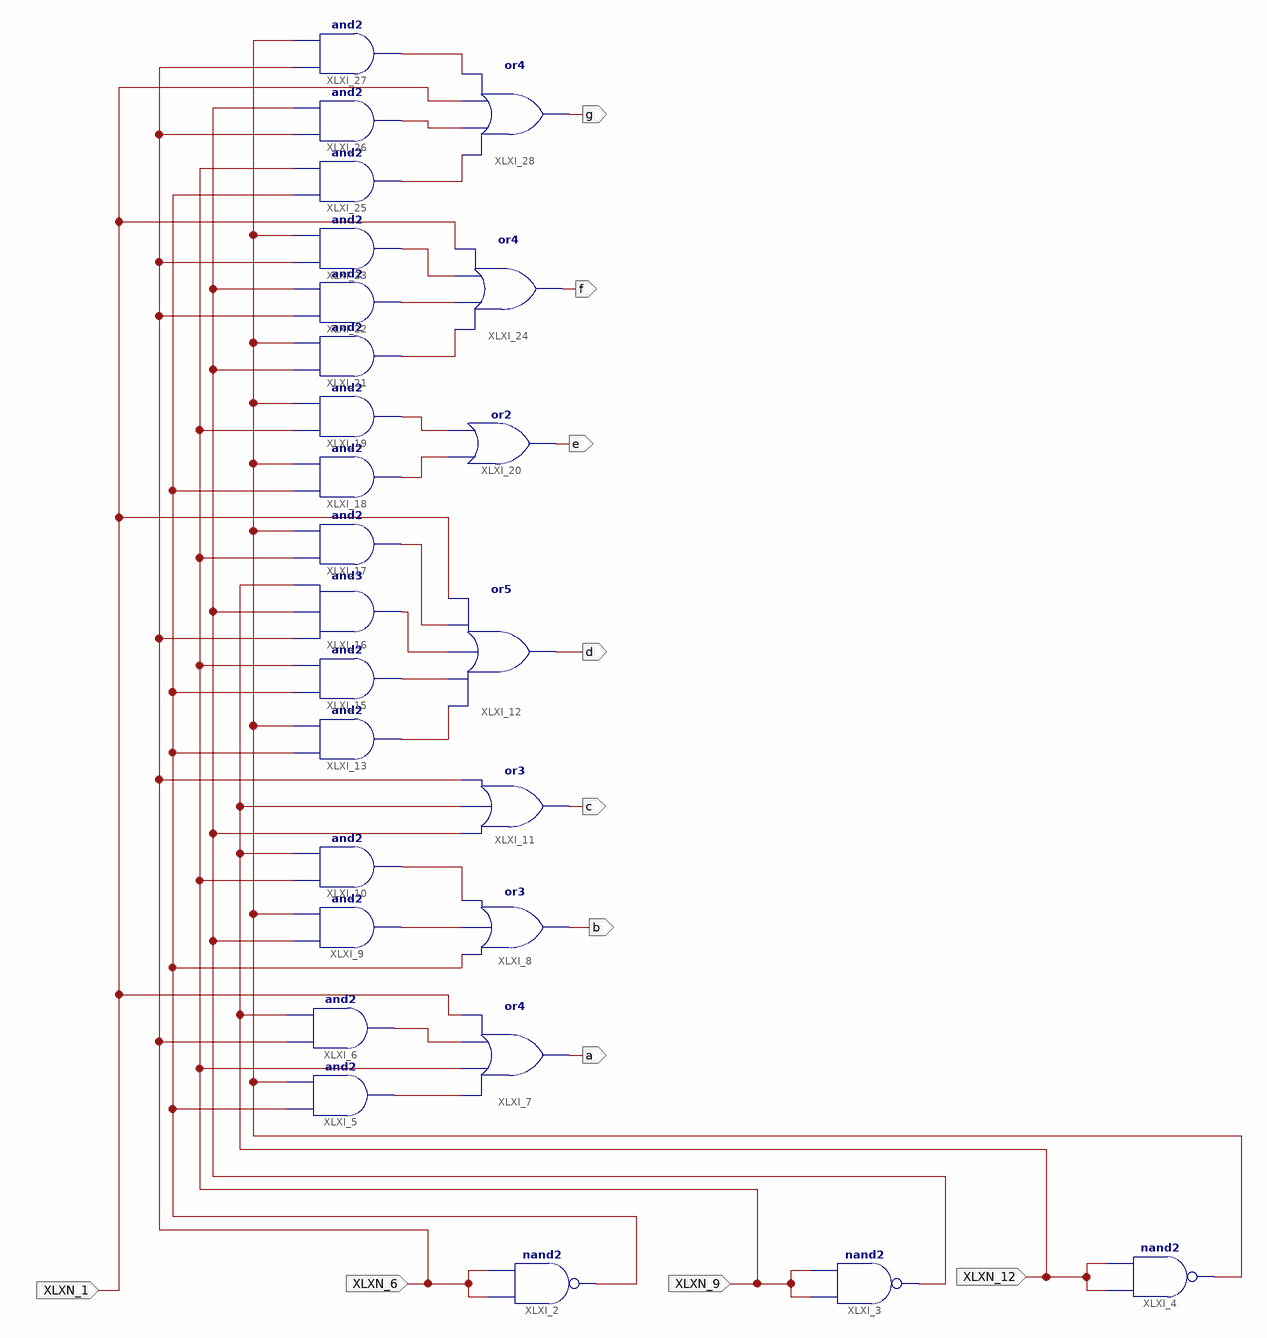
[diagram p0: schematic sheet 1]
// Xilinx ISE schematic decoder.sch (spartan6) as structural Verilog: 26 symbols, 11 ports
module decoder (
  input  XLXN_1,
  input  XLXN_6,
  input  XLXN_9,
  input  XLXN_12,
  output a,
  output b,
  output c,
  output d,
  output e,
  output f,
  output g
);

  wire XLXN_7, XLXN_10, XLXN_13, XLXN_14, XLXN_15, XLXN_19, XLXN_20, XLXN_32, XLXN_33, XLXN_34, XLXN_37,
       XLXN_40, XLXN_41, XLXN_44, XLXN_45, XLXN_46, XLXN_48, XLXN_49, XLXN_50;

  nand XLXI_2 (XLXN_7, XLXN_6, XLXN_6);
  nand XLXI_3 (XLXN_10, XLXN_9, XLXN_9);
  nand XLXI_4 (XLXN_13, XLXN_12, XLXN_12);
  and XLXI_5 (XLXN_14, XLXN_7, XLXN_13);
  and XLXI_6 (XLXN_15, XLXN_6, XLXN_12);
  or XLXI_7 (a, XLXN_14, XLXN_9, XLXN_15, XLXN_1);
  or XLXI_8 (b, XLXN_7, XLXN_19, XLXN_20);
  and XLXI_9 (XLXN_19, XLXN_10, XLXN_13);
  and XLXI_10 (XLXN_20, XLXN_9, XLXN_12);
  or XLXI_11 (c, XLXN_10, XLXN_12, XLXN_6);
  and XLXI_13 (XLXN_32, XLXN_7, XLXN_13);
  or XLXI_12 (d, XLXN_32, XLXN_33, XLXN_34, XLXN_37, XLXN_1);
  and XLXI_15 (XLXN_33, XLXN_7, XLXN_9);
  and XLXI_16 (XLXN_34, XLXN_6, XLXN_10, XLXN_12);
  and XLXI_17 (XLXN_37, XLXN_9, XLXN_13);
  and XLXI_18 (XLXN_41, XLXN_7, XLXN_13);
  and XLXI_19 (XLXN_40, XLXN_9, XLXN_13);
  or XLXI_20 (e, XLXN_41, XLXN_40);
  and XLXI_21 (XLXN_44, XLXN_10, XLXN_13);
  and XLXI_22 (XLXN_45, XLXN_6, XLXN_10);
  and XLXI_23 (XLXN_46, XLXN_6, XLXN_13);
  or XLXI_24 (f, XLXN_44, XLXN_45, XLXN_46, XLXN_1);
  and XLXI_25 (XLXN_50, XLXN_7, XLXN_9);
  and XLXI_26 (XLXN_49, XLXN_6, XLXN_10);
  and XLXI_27 (XLXN_48, XLXN_6, XLXN_13);
  or XLXI_28 (g, XLXN_50, XLXN_49, XLXN_1, XLXN_48);
endmodule
